# EAGLE design main_pcb (EAGLE 8.4.1)
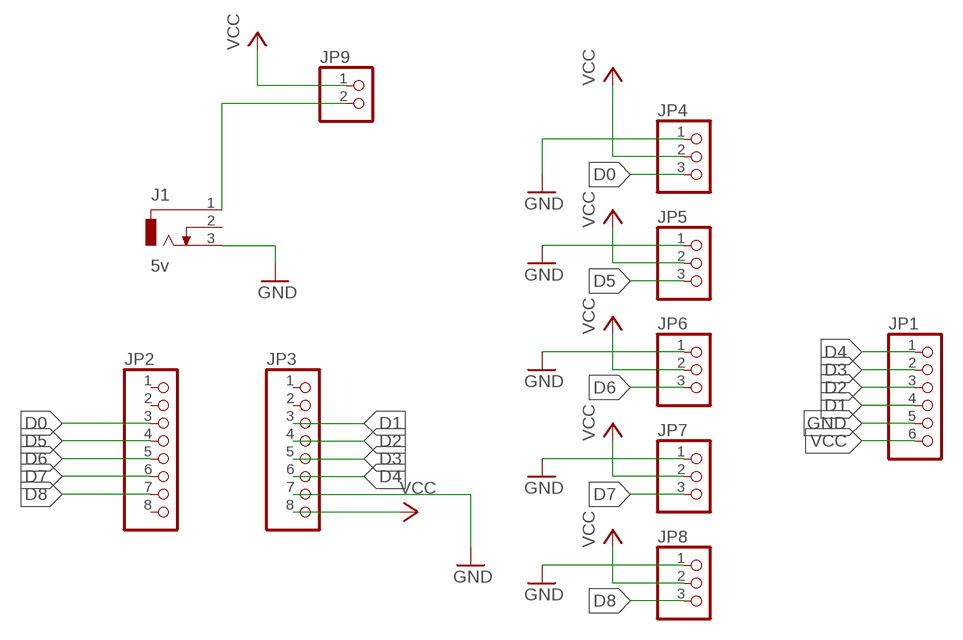
[diagram p0: schematic, sheet 1]

## Parts
J1  5v  DCJ0303  [DCJ0303]
JP1  PINHD-1X6  [1X06]
JP2  PINHD-1X8  [1X08]
JP3  PINHD-1X8  [1X08]
JP4  PINHD-1X3  [1X03]
JP5  PINHD-1X3  [1X03]
JP6  PINHD-1X3  [1X03]
JP7  PINHD-1X3  [1X03]
JP8  PINHD-1X3  [1X03]
JP9  PINHD-1X2  [1X02]

## Nets
D0: JP2.3 JP4.3
D1: JP1.4 JP3.3
D2: JP1.3 JP3.4
D3: JP1.2 JP3.5
D4: JP1.1 JP3.6
D5: JP2.4 JP5.3
D6: JP2.5 JP6.3
D7: JP2.6 JP7.3
D8: JP2.7 JP8.3
GND: J1.3 JP1.5 JP3.7 JP4.1 JP5.1 JP6.1 JP7.1 JP8.1
N$1: J1.1 JP9.2
VCC: JP1.6 JP3.8 JP4.2 JP5.2 JP6.2 JP7.2 JP8.2 JP9.1
Unconnected: J1.2 JP2.1 JP2.2 JP2.8 JP3.1 JP3.2

## Library data of the parts
J1 = con-jack:DCJ0303: DC POWER JACK Source: DCJ0303.pdf; OC_FARNELL: unknown; OC_NEWARK: unknown
JP1 = pinhead:PINHD-1X6: PIN HEADER
JP2 JP3 = pinhead:PINHD-1X8: PIN HEADER
JP4-JP8 = pinhead:PINHD-1X3: PIN HEADER
JP9 = pinhead:PINHD-1X2: PIN HEADER

## Board
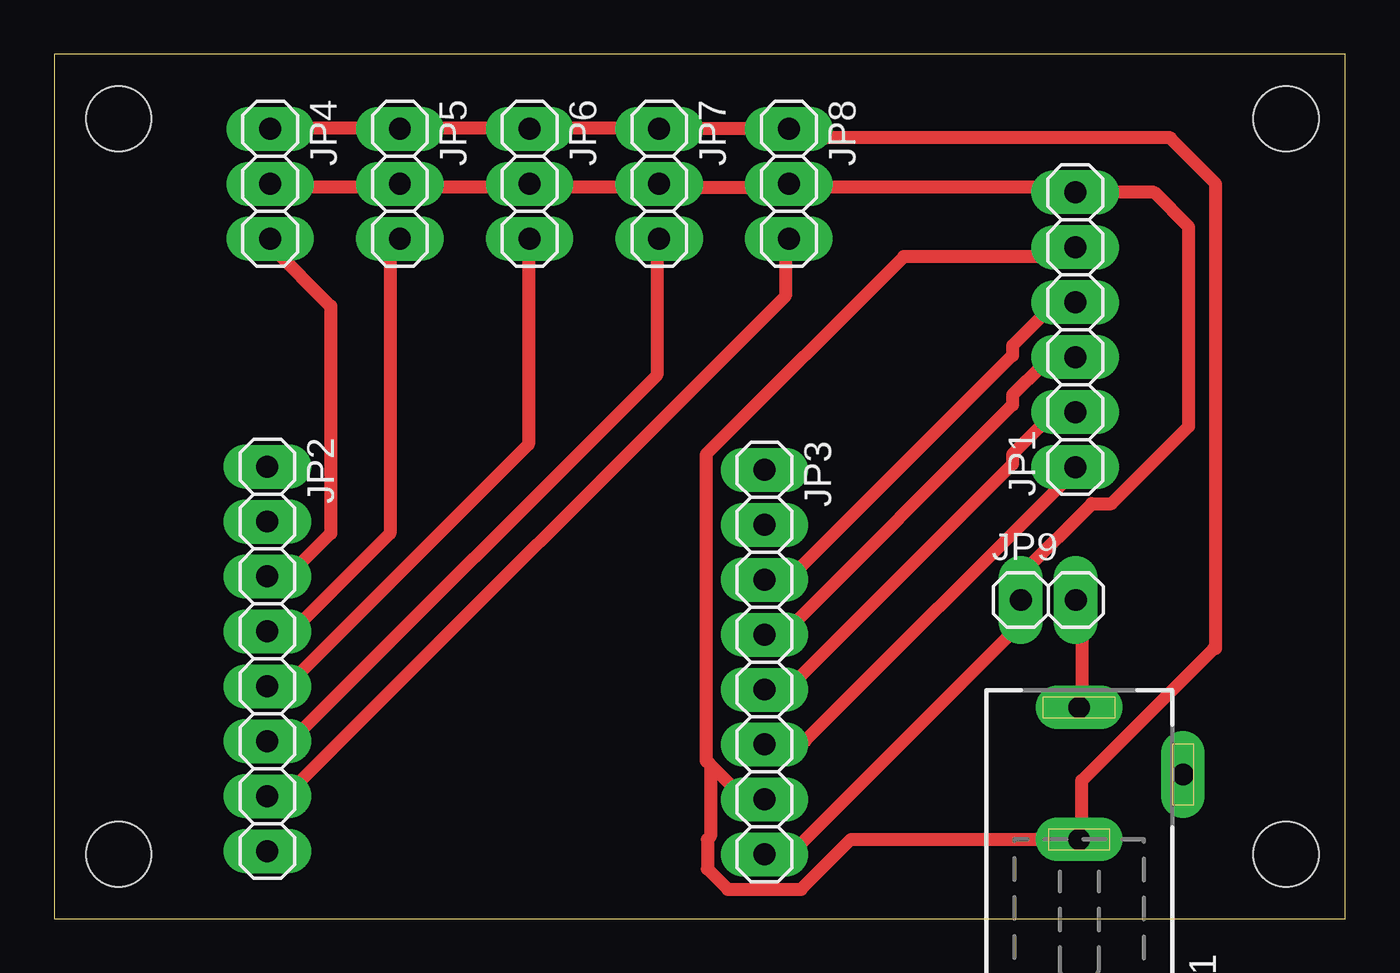
[diagram p1: board, top side]

Size 59.75 x 40 mm. Coordinates in mm from the lower left corner, seen from the top.
Outline: 0,0 59.75,0 59.75,40 0,40 0,0
Copper layers 1: Top 0.035mm
Design rules "default *": minimum track width 24mil, minimum drill 0.35mm, track to track 12mil, track to pad 12mil, pad to pad 6mil, via to via 6mil, smd to smd 6mil, copper to edge 40mil, drill to drill 6mil, minimum pad ring 20mil, minimum via ring 8mil, stop-mask expansion 4mil, vias tented up to drill 0mil, thermal gap 10mil
Holes 3 mm at 3,3 3,37 57,37 57,3

### Footprints (pad centres in the part's own frame; a part is rotated, then mirrored left to right if it is on the bottom)
DCJ0303 = drill 1 pad 2 long: 1 0,3.1; 2 4.8,0; 3 0,-3
1X06 = drill 1.016 long: 1 -6.35,0; 2 -3.81,0; 3 -1.27,0; 4 1.27,0; 5 3.81,0; 6 6.35,0
1X08 = drill 1.016 long: 1 -8.89,0; 2 -6.35,0; 3 -3.81,0; 4 -1.27,0; 5 1.27,0; 6 3.81,0; 7 6.35,0; 8 8.89,0
1X03 = drill 1.016 long: 1 -2.54,0; 2 0,0; 3 2.54,0
1X02 = drill 1.016 long: 1 -1.27,0; 2 1.27,0

### Placement (x,y rotation side)
J1  47.43,6.68 0 top
JP1  47.25,27.25 90 top
JP2  9.87,12.03 270 top
JP3  32.87,11.88 270 top
JP4  10,34 270 top
JP5  16,34 270 top
JP6  22,34 270 top
JP7  28,34 270 top
JP8  34,34 270 top
JP9  46,14.75 0 top

### Tracks (layer width: path | path; a pad name or v marks a point on that pad's centre or on a via)
D0
  Top 0.61: JP2.3 10.06,16 10.97,16 12.8,17.83 12.8,28.35 10.06,31.09 JP4.3
D1
  Top 0.61: JP3.3 32.92,16 34.29,16 44.35,26.06 44.35,26.52 46.18,28.35 47.09,28.35 JP1.4
D2
  Top 0.61: JP3.4 32.92,13.26 33.83,13.26 44.35,23.77 44.35,24.23 45.72,25.6 47.09,25.6 JP1.3
D3
  Top 0.61: JP3.5 32.92,10.97 34.29,10.97 44.35,21.03 44.35,21.49 46.18,23.32 47.09,23.32 JP1.2
D4
  Top 0.61: JP3.6 32.92,8.23 34.75,8.23 47.09,20.57 JP1.1
D5
  Top 0.61: JP2.4 10.06,13.72 11.43,13.72 15.54,17.83 15.54,31.09 JP5.3
D6
  Top 0.61: JP2.5 10.06,10.97 10.97,10.97 21.95,21.95 21.95,31.09 JP6.3
D7
  Top 0.61: JP2.6 10.06,8.23 10.97,8.23 27.89,25.15 27.89,31.09 JP7.3
D8
  Top 0.61: JP2.7 10.06,5.94 10.97,5.94 33.83,28.8 33.83,31.09 JP8.3
GND
  Top 0.61: 30.37,7.12 31.55,5.94 32.46,5.94 JP3.7 | 30.37,7.12 30.18,7.32 30.18,21.49 39.32,30.63 47.09,30.63 JP1.5 | 30.37,7.12 30.37,3.81 30.23,3.66 30.23,2.32 31.18,1.36 34.56,1.36 36.88,3.68 J1.3 47.55,4.12 47.55,6.4 53.65,12.5 53.75,12.5 53.75,34 51.65,36.1 | 51.65,36.1 51.63,36.12 | JP4.1 10.06,36.58 15.54,36.58 JP5.1 16,36.58 21.95,36.58 JP6.1 22.4,36.58 27.89,36.58 JP7.1 28.35,36.58 33.83,36.58 JP8.1 34.29,36.12 51.66,36.12 51.65,36.1
N$1
  Top 0.61: J1.1 47.55,10.06 47.55,14.63 JP9.2
VCC
  Top 0.61: JP3.8 32.92,3.2 34.29,3.2 44.35,13.26 44.35,14.63 JP9.1 44.81,15.09 44.81,16 48.01,19.2 48.92,19.2 52.5,22.78 52.5,32 50.9,33.6 JP1.6 | 48.46,33.38 47.55,33.38 JP1.6 | JP4.2 10.06,33.83 15.54,33.83 JP5.2 16,33.83 21.95,33.83 JP6.2 22.4,33.83 27.89,33.83 JP7.2 28.35,33.83 33.83,33.83 JP8.2 34.29,33.83 47.09,33.83 JP1.6

### Text on the board
Pads: - | + | MANIAK_dobrii 2017 | gnd | C | psw | gnd